# EAGLE schematic untitled (EAGLE 8.0.1)
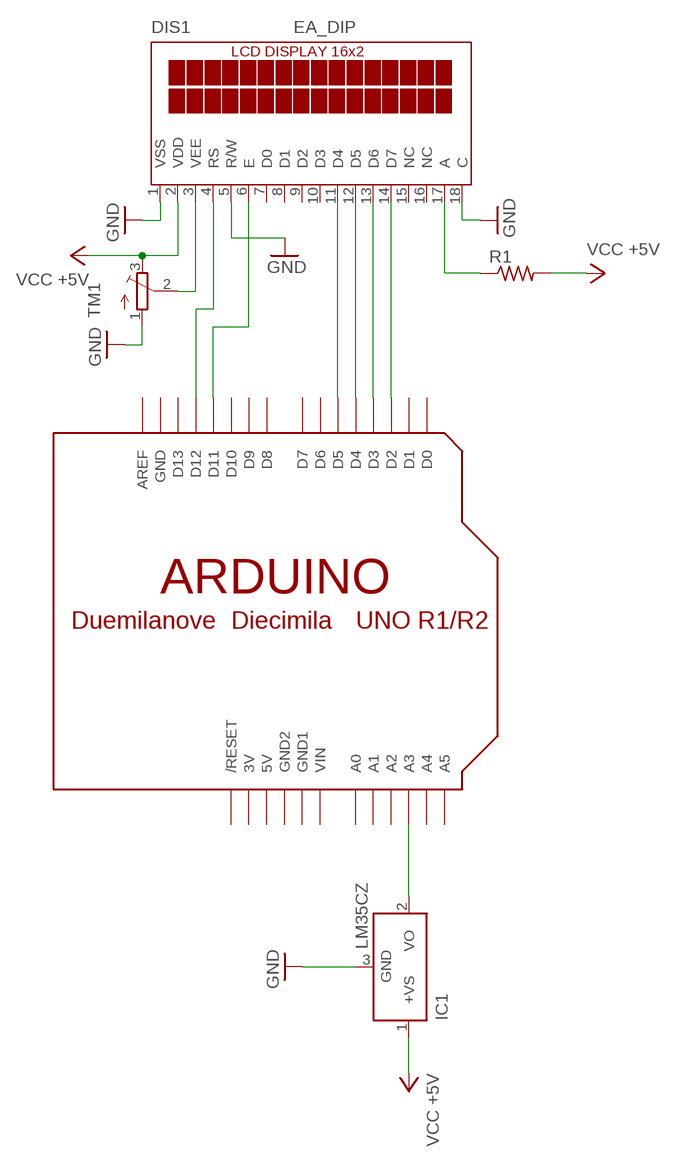
[diagram p0: schematic, sheet 1]

## Parts
DIS1  EA_DIP  [EA_DIP]
IC1  LM35CZ  [TO92]
R1  R-US_0204/5  [0204/5]
TM1  TRIMPOT3386  [TRIM-3386]
U$1  ARDUINOUNO  [ARDUINO]

## Nets
GND: DIS1.1(VSS) DIS1.5(R/W) DIS1.18(C) IC1.3(GND) TM1.1(A)
N$1: DIS1.14(D7) U$1.D2
N$2: DIS1.13(D6) U$1.D3
N$3: DIS1.12(D5) U$1.D4
N$4: DIS1.11(D4) U$1.D5
N$5: DIS1.17(A) R1.1
N$8: DIS1.3(VEE) TM1.2(S)
N$9: DIS1.4(RS) U$1.D12
N$10: DIS1.6(E) U$1.D11
N$12: IC1.2(VO) U$1.A3
VCC: DIS1.2(VDD) IC1.1(+VS) R1.2 TM1.3(E) ; supply symbol labelled VCC +5V
Unconnected: DIS1.7(D0) DIS1.8(D1) DIS1.9(D2) DIS1.10(D3) DIS1.15(NC) DIS1.16(NC) U$1.A0 U$1.A1 U$1.A2 U$1.A4 U$1.A5 U$1.AREF U$1.D0 U$1.D1 U$1.D6 U$1.D7 U$1.D8 U$1.D9 U$1.D10 U$1.D13 U$1.RESET(/RESET)

## Power pins joined to a net without a drawn wire
3V: U$1.3V
5V: U$1.5V
GND: U$1.GND
GND1: U$1.GND1
GND2: U$1.GND2
VIN: U$1.VIN

## Library data of the parts
DIS1 = display-lcd:EA_DIP: LCD-MODUL 2x16 - 6,68mm, INKL. KONTROLLER HD44780 Source: Data sheet <http://www.lcd-module.de/pdf/doma/dip162-d.pdf>
IC1 = lm35:LM35: Single-Supply Centigrade Temperature Sensor Vout = (10mV/°C x Temp °C) +5mmmV Source: http://www.national.com/ds/LM/LM35.pdf
R1 = adafruit:R-US_: RESISTOR, American symbol
TM1 = adafruit:TRIMPOT: SMT trimmer potentiometer part number TC33X http://www.ladyada.net/library/eagle
U$1 = adafruit:ARDUINO: Arduino Diecimila/Duemilanove Make a shield with ease, this package has all the named pins as well as the two mounting drill holes and an outline of the USB and DC power connector. The outline is on the DIMENSION layer, so if your board house uses it they will cut the outline to match. http://www.ladyada.net/library/pcb/eaglelibrary.html